# Altium schematic sheet Main.SchDoc
size 420 x 297 mm; SheetNumber: 1; SheetTotal: 4
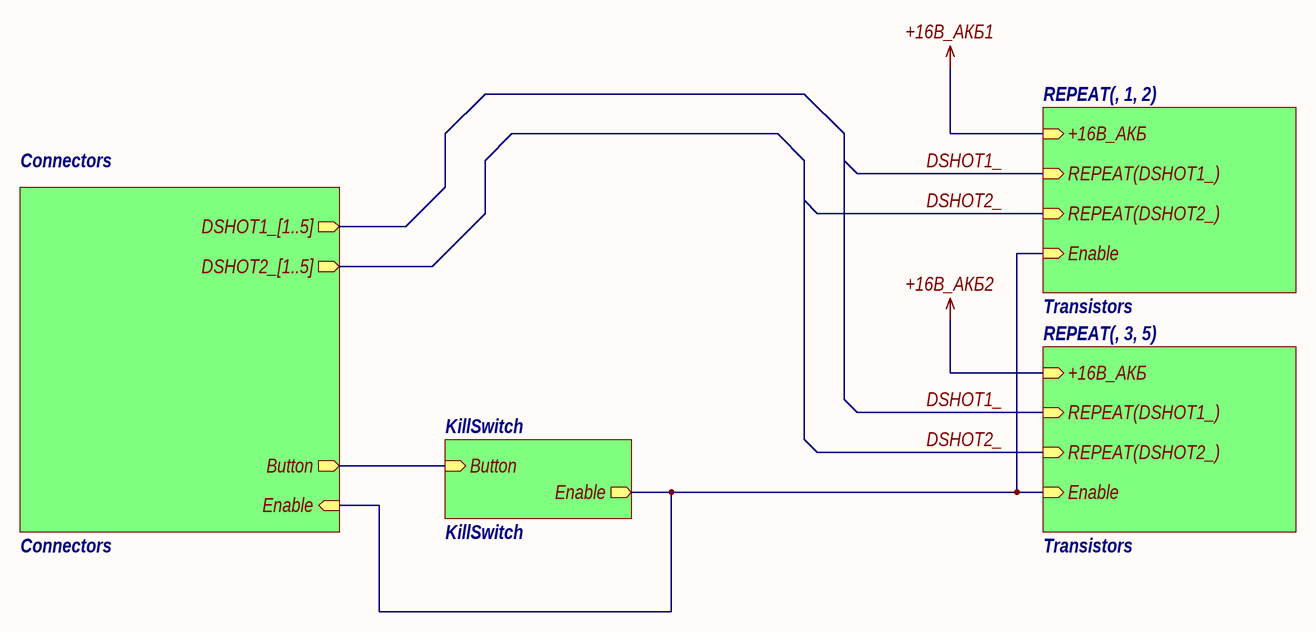
[diagram p0: Main.SchDoc]

## Sub-sheets
Connectors = Connectors: DSHOT1_[1..5] (out), DSHOT2_[1..5] (out), Button (out), Enable (in)
KillSwitch = KillSwitch: Button (in), Enable (out)
REPEAT(, 1, 2) = Transistors: REPEAT(DSHOT1_) (in), REPEAT(DSHOT2_) (in), Enable (in), +16В_АКБ (in)
REPEAT(, 3, 5) = Transistors: REPEAT(DSHOT1_) (in), REPEAT(DSHOT2_) (in), Enable (in), +16В_АКБ (in)

## Nets
+16В_АКБ1: sheet REPEAT(, 1, 2)/+16В_АКБ
+16В_АКБ2: sheet REPEAT(, 3, 5)/+16В_АКБ
DSHOT1_: sheet REPEAT(, 1, 2)/REPEAT(DSHOT1_), sheet REPEAT(, 3, 5)/REPEAT(DSHOT1_)
DSHOT2_: sheet REPEAT(, 1, 2)/REPEAT(DSHOT2_), sheet REPEAT(, 3, 5)/REPEAT(DSHOT2_)
(unnamed): sheet Connectors/Button, sheet KillSwitch/Button
(unnamed): sheet Connectors/Enable, sheet KillSwitch/Enable, sheet REPEAT(, 1, 2)/Enable, sheet REPEAT(, 3, 5)/Enable

## Notes on the sheet
- Перв. примен.
- Справ. №
- Подп. и дата
- Инв. № дубл.
- Взам. инв. №
- Разраб.
- Изм.
- Лист
- № докум.
- Подп.
- Дата
- Лит.
- Масса
- Масштаб
- Пров.
- Т.контр.
- Схема электрическая принципиальная
- Листов
- Инв. № подл.
- Утв.
- Н.контр.
- Копировал
- Формат А3